# Altium schematic sheet 20210523_EleksTube_IPS_extend_v1_1.SchDoc
size A4
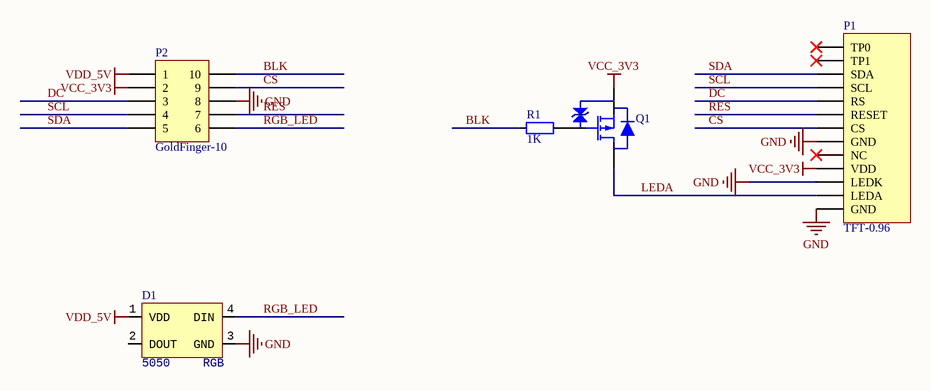
[diagram p0: 20210523_EleksTube_IPS_extend_v1_1.SchDoc]

## Parts
D1  Type: 5050  [LED_5050_WS2812B]  (hidden comment: RGB)
P1  TFT-0.96  [TFT-0.96]
P2  GoldFinger-10  [GoldFinger-10]
Q1  AO3415A  [SOT23-3]  (value not drawn)
R1  1K  [RES_0402]

## Nets
GND: D1.3(GND) P1.8(GND) P1.11(LEDK) P1.13(GND) P2.8
VCC_3V3: P1.10(VDD) P2.2 Q1.2(S)
VDD_5V: D1.1(VDD) P2.1
BLK: P2.10 R1.1
CS: P1.7(CS) P2.9
DC: P1.5(RS) P2.3
LEDA: P1.12(LEDA) Q1.3(D)
RES: P1.6(RESET) P2.7
RGB_LED: D1.4(DIN) P2.6
SCL: P1.4(SCL) P2.4
SDA: P1.3(SDA) P2.5
NetQ1_1: Q1.1(G) R1.2

Not connected (* = marked no-connect by the designer): D1 2(DOUT); P1 1(TP0)* 2(TP1)* 9(NC)*

## Library data of the parts
D1 = LED_5050_WS2812B: LED; Value: RGB
P1 = Header 13: Header, 13-Pin; LatestRevisionDate: 17-Jul-2002; LatestRevisionNote: Re-released for DXP Platform.; Publisher: Altium Limited
P2 = GoldFinger-10: Header, 5-Pin, Dual row; LatestRevisionDate: 17-Jul-2002; LatestRevisionNote: Re-released for DXP Platform.; Publisher: Altium Limited
Q1 = AO3415A: MOSFET; Published: 8-Jun-2000; LatestRevisionDate: 17-Jul-2002; LatestRevisionNote: Re-released for DXP Platform.; PackageVersion: 1995/1996; PackageReference: E3; Publisher: Altium Limited; PackageDescription: TO, Flat Index; 3 In-Line, Axial Leads; Body Dia. 4.6mm; Lead Dia. 0.5 mm (max)
R1 = 电阻-0402: Resistor; Value: 22R